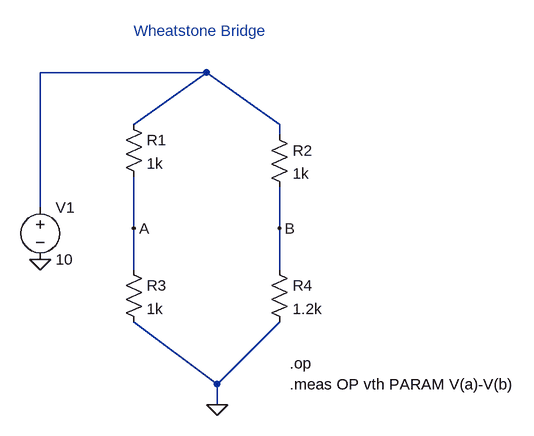
[diagram p0: schematic Bridge_Analysis_Vth.asc]
Bridge_Analysis_Vth.asc, the LTspice schematic file:
Version 4
SHEET 1 880 680
WIRE 336 -112 80 -112
WIRE 224 -32 336 -112
WIRE 448 -32 336 -112
WIRE 448 -16 448 -32
WIRE 80 96 80 -112
WIRE 224 128 224 48
WIRE 448 128 448 64
WIRE 224 192 224 128
WIRE 448 192 448 128
WIRE 352 368 224 272
WIRE 352 368 448 272
WIRE 352 400 352 368
FLAG 352 400 0
FLAG 80 176 0
FLAG 224 128 A
FLAG 448 128 B
SYMBOL voltage 80 80 R0
WINDOW 123 0 0 Left 0
WINDOW 39 0 0 Left 0
SYMATTR InstName V1
SYMATTR Value 10
SYMBOL res 208 -48 R0
SYMATTR InstName R1
SYMATTR Value 1k
SYMBOL res 432 -32 R0
SYMATTR InstName R2
SYMATTR Value 1k
SYMBOL res 208 176 R0
SYMATTR InstName R3
SYMATTR Value 1k
SYMBOL res 432 176 R0
SYMATTR InstName R4
SYMATTR Value 1.2k
TEXT 224 -176 Left 2 ;Wheatstone Bridge
TEXT 464 368 Left 2 !.meas OP vth PARAM V(a)-V(b)
TEXT 464 336 Left 2 !.op

The netlist it stands for:
* Bridge_Analysis_Vth.asc
V1 N001 0 10
R1 N001 A 1k
R2 N001 B 1k
R3 A 0 1k
R4 B 0 1.2k
* Wheatstone Bridge
.meas OP vth PARAM V(a)-V(b)
.op
.backanno
.end